# EasyEDA Pro project ProProject_STM32F103C6T6系统板_2024-03-26.epro

# Schematic Schematic1
Create Date: 2024-03-13; Page Name: P1; Project Name: STM32F103C6T6系统板; Schematic Name: Schematic1; Update Date: 2024-03-13; Company: 嘉立创EDA; Page Size: A4; Version: V1.0
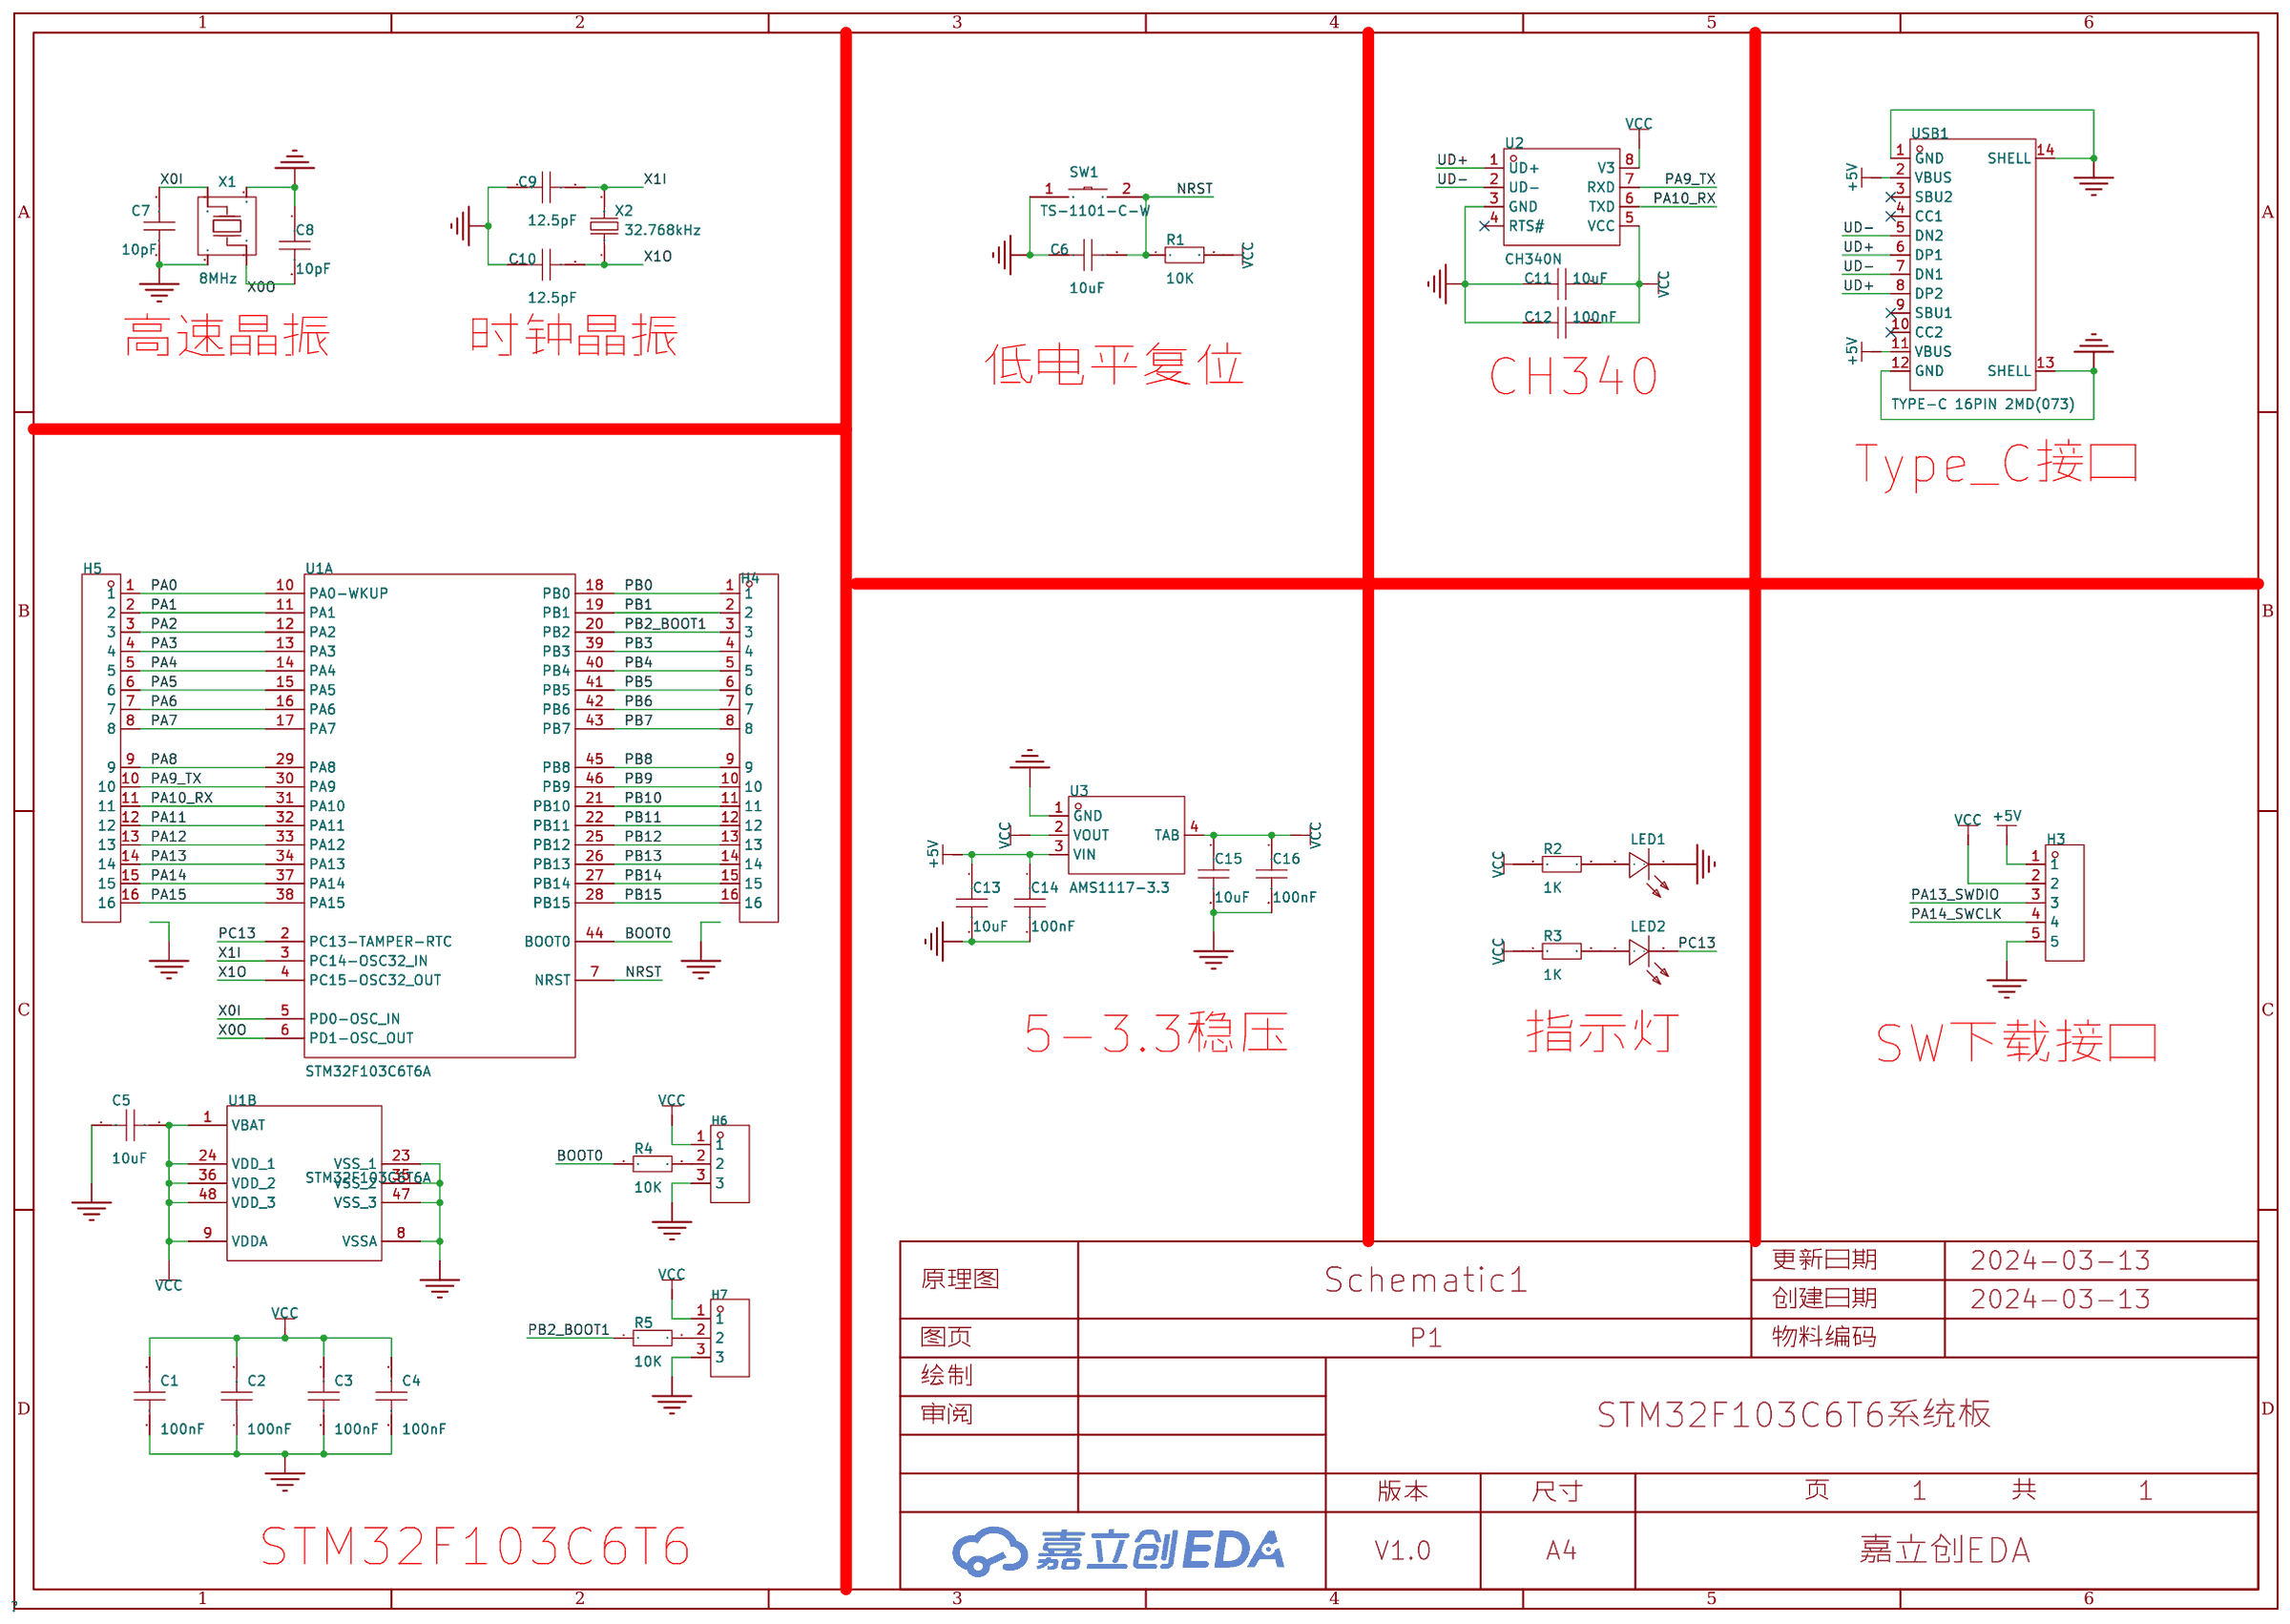
[diagram p0: schematic sheet]

## Parts
C1  100nF  [C0603]
C2  100nF  [C0603]
C3  100nF  [C0603]
C4  100nF  [C0603]
C5  10uF  [C0603]
C6  10uF  [C0603]
C7  10pF  [C0603]
C8  10pF  [C0603]
C9  12.5pF  [C0603]
C10  12.5pF  [C0603]
C11  10uF  [C0603]
C12  100nF  [C0603]
C13  10uF  [C0603]
C14  100nF  [C0603]
C15  10uF  [C0603]
C16  100nF  [C0603]
H3  PZ254-1-05-W-8.5  [HDR-TH_5P-P2.54-H-M-W10.4-N]
H4  X6511WV-20H-C60D30  [HDR-TH_20P-P2.54-V-M]
H5  X6511WV-20H-C60D30  [HDR-TH_20P-P2.54-V-M]
H6  PZ254V-11-03P  [HDR-TH_3P-P2.54-V-M]
H7  PZ254V-11-03P  [HDR-TH_3P-P2.54-V-M]
LED1  NCD0805R1  [LED0805-R-RD]
LED2  NCD0805R1  [LED0805-R-RD]
R1  10K  [R0603]
R2  1K  [R0603]
R3  1K  [R0603]
R4  10K  [R0603]
R5  10K  [R0603]
SW1  TS-1101-C-W  [SW-SMD_L6.0-W3.3-LS8.0]
U1  STM32F103C6T6A  [LQFP-48_L7.0-W7.0-P0.50-LS9.0-BL]  (sections 1,2)
U2  CH340N  [SOP-8_L4.9-W3.9-P1.27-LS6.0-BL]
U3  AMS1117-3.3  [SOT-223-3_L6.5-W3.5-P3.05-LS7.0]
USB1  TYPE-C 16PIN 2MD(073)  [USB-C-SMD_TYPE-C-6PIN-2MD-073]
X1  8MHz  [OSC-SMD_4P-L3.2-W2.5-BL]
X2  32.768kHz  [FC-135R_L3.2-W1.5]

## Library data of the parts
C1-C16 = CAP_0603: Supplier Footprint: 0603
H3 = PZ254-1-05-W-8.5: 插针结构:1x5P;间距:2.54mm;行距:-;圆针/方针:方针;安装类型:弯插;排数:单排;总PIN位数:5P;额定电流:3A;额定电压:-;配合针长度:6mm;塑高:2.5mm;端接针长度:-;触头材质:-;工作温度范围:-40℃~+105℃;焊接温度(最大值):260℃@10S;颜色:黑色;; LCSC Part Name: 1x5P 间距:2.54mm 方针 弯插; Supplier Part: C2894947; Manufacturer: HCTL(华灿天禄); Supplier Footprint: 弯插,P=2.54mm; JLCPCB Part Class: 扩展库; Datasheet: https://atta.szlcsc.com/upload/public/pdf/source/20230609/872AF364EDF8DB2CAF0930EAB94ECB6E.pdf; Supplier: LCSC; Pin Structure: 1x5P; Pitch: 2.54mm; Circluar Pins/Square Pins: 方针; Mounting Type: 弯插; Number of Rows: 单排; Number of Pins: 5P; Current Rating (Max): 3A; Length of Mating Pin: 6mm; Insulation Height: 2.5mm; Operating Temperature Range: -40℃~+105℃; Soldering Temperature(Max): 260℃@10S; Color: 黑色
H4 H5 = X6511WV-20H-C60D30: 插针结构:1x20P;间距:2.54mm;行距:2.54mm;圆针/方针:方针;安装类型:直插;排数:单排;总PIN位数:20P;额定电流:3A;额定电压:250V;配合针长度:6mm;塑高:2.5mm;端接针长度:3mm;触头材质:黄铜;触头镀层:金;工作温度范围:-40℃~+105℃;焊接温度(最大值):260℃;颜色:黑色;; LCSC Part Name: 1x20P 间距:2.54mm 方针 直插; Supplier Part: C725952; Manufacturer: XKB Connection(中国星坤); Supplier Footprint: 插件,P=2.54mm; JLCPCB Part Class: 扩展库; Datasheet: https://atta.szlcsc.com/upload/public/pdf/source/20221108/2FDDF9C694C8EDC81165E23F2EAAE597.pdf; Supplier: LCSC; Pin Structure: 1x20P; Pitch: 2.54mm; Row Spacing: 2.54mm; Circluar Pins/Square Pins: 方针; Mounting Type: 直插; Number of Rows: 单排; Number of Pins: 20P; Current Rating (Max): 3A; Voltage Rating (Max): 250V; Length of Mating Pin: 6mm; Insulation Height: 2.5mm; Length of End Connection Pin: 3mm; Contact Material: 黄铜; Contact Plating: 金; Operating Temperature Range: -40℃~+105℃; Soldering Temperature(Max): 260℃; Color: 黑色
H6 H7 = PZ254V-11-03P: 插针结构:1x3P;间距:2.54mm;行距:-;圆针/方针:方针;安装类型:直插;排数:单排;总PIN位数:3P;额定电流:3A;额定电压:250V;配合针长度:6mm;塑高:2.5mm;端接针长度:3mm;工作温度范围:-40℃~+105℃;颜色:黑色;; LCSC Part Name: 间距:2.54mm 1x3P 直插 方针; Supplier Part: C2937625; Manufacturer: XFCN(兴飞); Supplier Footprint: 插件,P=2.54mm; JLCPCB Part Class: 扩展库; Datasheet: https://atta.szlcsc.com/upload/public/pdf/source/20200309/C492402_8335C3D49C4E4C618838D59BB1D024C1.pdf; Supplier: LCSC; Pin Structure: 1x3P; Pitch: 2.54mm; Circluar Pins/Square Pins: 方针; Mounting Type: 直插; Number of Rows: 单排; Number of Pins: 3P; Current Rating (Max): 3A; Voltage Rating (Max): 250V; Length of Mating Pin: 6mm; Insulation Height: 2.5mm; Length of End Connection Pin: 3mm; Operating Temperature Range: -40℃~+105℃; Color: 黑色
LED1 LED2 = NCD0805R1: 灯头类型:-;发光颜色:红色;正向电压(VF):1.6V~2.6V;功率:65mW;正向电流:20mA;主波长:615nm~630nm;二极管配置:独立二极管;透镜颜色:无色透明透镜;色温:-;发光强度:67mcd~195mcd;发光角度:130°;载带方式:-;工作温度:-30℃~+85℃;; Supplier Part: C84256; Manufacturer: 国星光电; Supplier Footprint: 0805; JLCPCB Part Class: 基础库; Datasheet: https://atta.szlcsc.com/upload/public/pdf/source/20200820/C84256_F0A75A43B3EAD75808600A0514C76B99.pdf; Supplier: LCSC; Emitted Color: 红色; Forward Voltage (VF): 1.6V~2.6V; Power Dissipation: 65mW; Forward Current: 20mA; Dominant Wavelength: 615nm~630nm; Diode Configuration: 独立二极管; Lens Color: 无色透明透镜; Luminous Intensity: 67mcd~195mcd; Viewing Angle: 130°; Operating Temperature: -30℃~+85℃
R1-R5 = Res_0603: Supplier Footprint: 0603
SW1 = TS-1101-C-W: 电路结构:单刀单掷;按钮形状:矩形按钮;作用力:260gf;安装方式:立贴;开关长度:6mm;开关宽度:3.6mm;开关高度:2.5mm;带支架:不带;触点电流:50mA;额定电压(AC):-;额定电压(DC):12V;额定功率:-;绝缘电阻:-;带灯:无;机械寿命:5万次;; LCSC Part Name: 6*3.6*2.5mm 立贴 轻触开关; Supplier Part: C318938; Manufacturer: XKB Connectivity(中国星坤); Supplier Footprint: SMD; JLCPCB Part Class: 扩展库; Datasheet: https://atta.szlcsc.com/upload/public/pdf/source/20200227/C318938_C2E53B1EEDE37D980A33616AC086DE53.pdf; Supplier: LCSC; Circuit: 单刀单掷; Actuator Style: 矩形按钮; Operating Force: 260gf; Mounting Style: 立贴; Switch Length: 6mm; Switch Width: 3.6mm; Switch Height: 2.5mm; Strike Gundam: 不带; Contact Current: 50mA; Voltage Rating (DC): 12V; Actuator/Cap Color: 白色带淡绿; With Lamp: 无; Mechanical Life: 5万次; Operating Temperature: -30℃~+85℃
U1 = STM32F103C6T6A: CPU内核:CM3;程序存储容量:32KB;RAM总容量:10KB;GPIO端口数量:37;工作电压范围:2V~3.6V;CPU最大主频:72MHz;程序存储器类型:FLASH;; Supplier Part: C8303; Manufacturer: ST(意法半导体); Supplier Footprint: LQFP-48(7x7); JLCPCB Part Class: 扩展库; Datasheet: https://atta.szlcsc.com/upload/public/pdf/source/20140724/1457707171306.pdf; Supplier: LCSC; CPU Core: CM3; Program Storage Size: 32KB; RAM Size: 10KB; GPIO Ports Number: 37; Operating Voltage Range: 2V~3.6V; CPU Maximum Speed: 72MHz; Program Memory Type: FLASH; Operating Temperature Range: -40℃~+85℃; ADC (Bit): 12bit; Universal Serial Bus: 有; Peripheral/Function: DMA；片载温度传感器；PWM; Watchdog: 有; Infrared Data Association: 有; Low-Voltage Detect: 有; Direct Memory Access: 有; Internal Oscillator: 有
U2 = CH340N: LCSC Part Name: USB转串口芯片 CH340; Supplier Part: C2977777; Manufacturer: WCH(南京沁恒); Supplier Footprint: SOP-8; JLCPCB Part Class: 扩展库; Datasheet: https://atta.szlcsc.com/upload/public/pdf/source/20230530/6E401E9554E9F5311886CC8B3F89B62E.pdf; Supplier: LCSC
U3 = AMS1117-3.3_C5250992: 输出类型：固定 输出极性：正 最大输入电压：18V 输出电压：3.3V 输出电流：1A 电源纹波抑制比(PSRR)：60dB@(120Hz)。当前应用较多领域：三端稳压器，机顶盒; Supplier Part: C5250992; Manufacturer: TWGMC(台湾迪嘉); Supplier Footprint: SOT-223-3L; JLCPCB Part Class: 扩展库; Datasheet: https://atta.szlcsc.com/upload/public/pdf/source/20221109/A58A92B07670E85D28928AE371260E8D.pdf; Supplier: LCSC
USB1 = TYPE-C 16PIN 2MD(073): 连接器类型:Type-C;标准:-;公母:母;端口数量:1;触点数量:16P;安装方式:卧贴;额定电流 - 电源:5A;工作温度范围:-25℃~+85℃;; LCSC Part Name: Type-C 母 卧贴; Supplier Part: C2765186; Manufacturer: SHOU HAN(首韩); Supplier Footprint: SMD; JLCPCB Part Class: 扩展库; Datasheet: https://atta.szlcsc.com/upload/public/pdf/source/20211123/39B17C16241EAC15C5E277BDA434118E.pdf; Supplier: LCSC; Connector Type: Type-C; Gender: 母; Number of Ports: 1; Number of Contacts: 16P; Mounting Style: 卧贴; Current Rating - Power (Max): 5A; Operating Temperature Range: -25℃~+85℃
X1 = TAXM8M4RDBCCT2T: 晶振类型:贴片晶振;频率:8MHz;常温频差:±10ppm;外接负载电容:10pF;频率稳定度(全温):±15ppm;; LCSC Part Name: 8MHz ±10ppm 10pF; Supplier Part: C400090; Manufacturer: YJX(雅晶鑫); Supplier Footprint: SMD3225-4P; JLCPCB Part Class: 扩展库; Datasheet: https://atta.szlcsc.com/upload/public/pdf/source/20190626/C400090_CF95B89E745AFE4EF2E392EF8AC009D6.pdf; Supplier: LCSC; Crystal Type: 贴片晶振; Normal temperature Frequency Tolerance: ±10ppm; External load capacitor: 10pF; Frequency Stability(Full temperature range): ±15ppm; Equivalent Series Resistance (ESR): 250Ω; Operating Temperature: -40℃~+85℃
X2 = Q13FC13500004_C32346: 晶振类型:贴片晶振;频率:32.768kHz;常温频差:±20ppm;外接负载电容:12.5pF;; LCSC Part Name: 32.768kHz ±20ppm 12.5pF; Supplier Part: C32346; Manufacturer: EPSON(爱普生); Manufacturer Part: Q13FC13500004; Supplier Footprint: SMD3215-2P; JLCPCB Part Class: 基础库; Datasheet: https://atta.szlcsc.com/upload/public/pdf/source/20190108/C32346_746D6B07EAF90824457A96480007685F.pdf; Supplier: LCSC; Crystal Type: 贴片晶振; Normal temperature Frequency Tolerance: ±20ppm; External load capacitor: 12.5pF; Equivalent Series Resistance (ESR): 70kΩ; Operating Temperature: -40℃~+85℃

## Nets
+5V: C13.1 C14.1 H3.1 U3.3(VIN) USB1.2(VBUS) USB1.11(VBUS)
GND: C1.1 C2.1 C3.1 C4.1 C5.2 C6.2 C7.2 C8.1 C9.1 C10.1 C11.1 C12.1 C13.2 C14.2 C15.2 C16.2 H3.5 H6.3 H7.3 LED1.2(-) SW1.1 U1.8(VSSA) U1.23(VSS_1) U1.35(VSS_2) U1.47(VSS_3) U2.3(GND) U3.1(GND) USB1.1(GND) USB1.12(GND) USB1.13(SHELL) USB1.14(SHELL) X1.2 X1.4
VCC: C1.2 C2.2 C3.2 C4.2 C5.1 C11.2 C12.2 C15.1 C16.1 H3.2 H6.1 H7.1 R1.2 R2.1 R3.1 U1.1(VBAT) U1.9(VDDA) U1.24(VDD_1) U1.36(VDD_2) U1.48(VDD_3) U2.5(VCC) U2.8(V3) U3.2(VOUT) U3.4(TAB)
BOOT0: R4.1 U1.44(BOOT0)
NRST: C6.1 R1.1 SW1.2 U1.7(NRST)
PA0: H5.1 U1.10(PA0-WKUP)
PA1: H5.2 U1.11(PA1)
PA2: H5.3 U1.12(PA2)
PA3: H5.4 U1.13(PA3)
PA4: H5.5 U1.14(PA4)
PA5: H5.6 U1.15(PA5)
PA6: H5.7 U1.16(PA6)
PA7: H5.8 U1.17(PA7)
PA8: H5.9 U1.29(PA8)
PA9_TX: H5.10 U1.30(PA9) U2.7(RXD)
PA10_RX: H5.11 U1.31(PA10) U2.6(TXD)
PA11: H5.12 U1.32(PA11)
PA12: H5.13 U1.33(PA12)
PA13: H5.14 U1.34(PA13)
PA13_SWDIO: H3.3
PA14: H5.15 U1.37(PA14)
PA14_SWCLK: H3.4
PA15: H5.16 U1.38(PA15)
PB0: H4.1 U1.18(PB0)
PB1: H4.2 U1.19(PB1)
PB2_BOOT1: H4.3 R5.1 U1.20(PB2)
PB3: H4.4 U1.39(PB3)
PB4: H4.5 U1.40(PB4)
PB5: H4.6 U1.41(PB5)
PB6: H4.7 U1.42(PB6)
PB7: H4.8 U1.43(PB7)
PB8: H4.9 U1.45(PB8)
PB9: H4.10 U1.46(PB9)
PB10: H4.11 U1.21(PB10)
PB11: H4.12 U1.22(PB11)
PB12: H4.13 U1.25(PB12)
PB13: H4.14 U1.26(PB13)
PB14: H4.15 U1.27(PB14)
PB15: H4.16 U1.28(PB15)
PC13: LED2.2(-) U1.2(PC13-TAMPER-RTC)
UD+: U2.1(UD+) USB1.6(DP1) USB1.8(DP2)
UD-: U2.2(UD-) USB1.5(DN2) USB1.7(DN1)
X0I: C7.1 U1.5(PD0-OSC_IN) X1.3
X0O: C8.2 U1.6(PD1-OSC_OUT) X1.1
X1I: C9.2 U1.3(PC14-OSC32_IN) X2.2
X1O: C10.2 U1.4(PC15-OSC32_OUT) X2.1
$1N9882: H6.2 R4.2
$1N10003: H7.2 R5.2
Net-(LED1-1): LED1.1(+) R2.2
Net-(LED2-1): LED2.1(+) R3.2

Not connected (* = marked no-connect by the designer): U2 4(RTS#)*; USB1 3(SBU2)* 4(CC1)* 9(SBU1)* 10(CC2)*

## Notes on the sheet
- 高速晶振
- 时钟晶振
- 低电平复位
- CH340
- Type_C接口
- 5-3.3稳压
- 指示灯
- SW下载接口
- STM32F103C6T6

# Board PCB1
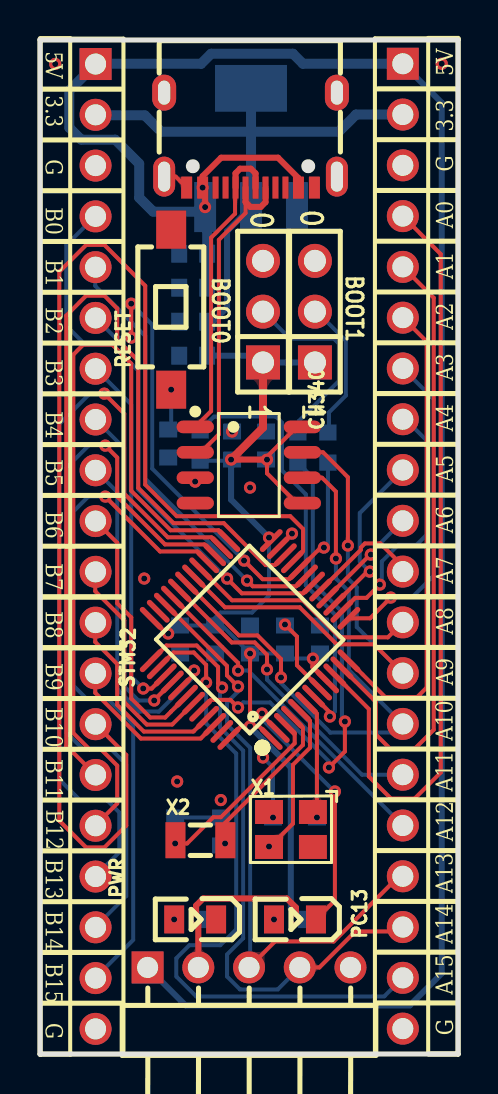
[diagram p1: board, top side]
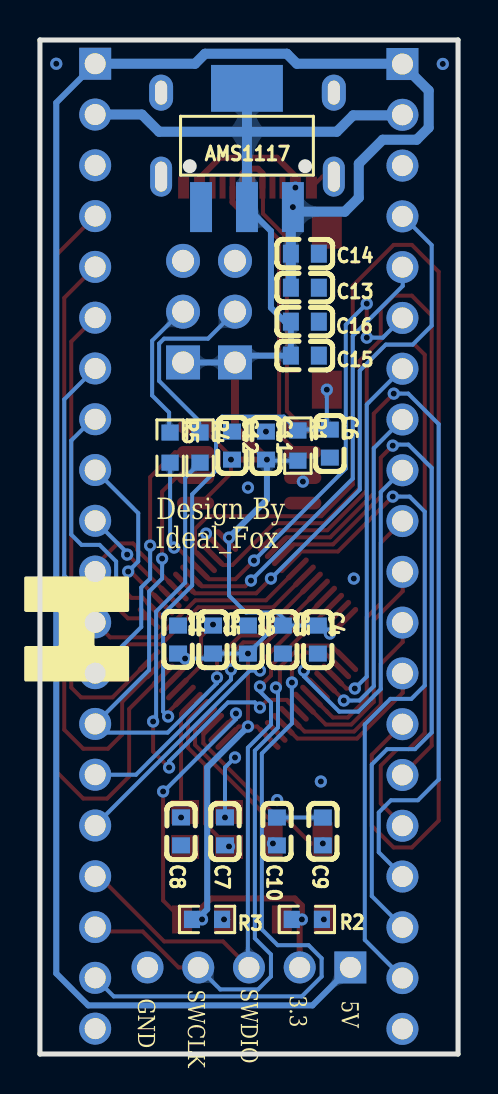
[diagram p2: board, bottom side, seen from below]

Outline 20.94 x 50.72 mm; copper layers: Top Layer, Bottom Layer. Coordinates in mm from the lower left corner of the outline.
Outline path: 0,50.72 20.94,50.72 20.94,0 0,0 0,50.72
Stack: Top Layer 0.035mm / Dielectric1 1.51mm FR4 er 4.5 / Bottom Layer 0.035mm

## Design rules (mm)
template: 自定义配置
spacing copperThickness1oz (default): track to track 0.15, other pairs 0.15 to 0.3
spacing copperThickness2oz: track to track 0.203, other pairs 0.152 to 0.3
track width copperThickness1oz (default): min 0.127, default 0.2, max 2.54
track width copperThickness2oz: min 0.203, default 0.254, max 2.54
differential pair differentialPair (default): width min 0.127, default 0.254, max 2.54; gap min 0.152, default 0.152
via viaSize (default): diameter min 0.5, default 0.5, max 10; hole min 0.3, default 0.3, max 6.3

## Placement (name value [footprint] x y rotation side)
AMS1117  AMS1117-3.3  [SOT-223-3_L6.5-W3.5-P3.05-LS7.0]  10.57 45.33 270 bottom
C1  100nF  [C0603]  14.02 20.73 270 bottom
C2  100nF  [C0603]  10.52 20.73 270 bottom
C3  100nF  [C0603]  8.77 20.73 90 bottom
C4  100nF  [C0603]  7.02 20.73 90 bottom
C5  10uF  [C0603]  12.27 20.73 90 bottom
C6  10uF  [C0603]  6.42 30.53 270 bottom
C7  10pF  [C0603]  11.67 11.13 90 bottom
C8  10pF  [C0603]  13.87 11.13 90 bottom
C9  12.5pF  [C0603]  6.77 11.13 270 bottom
C10  12.5pF  [C0603]  9.07 11.13 270 bottom
C11  10uF  [C0603]  9.62 30.43 270 bottom
C12  100nF  [C0603]  11.32 30.43 270 bottom
C13  10uF  [C0603]  7.67 38.33 180 bottom
C14  100nF  [C0603]  7.67 40.03 180 bottom
C15  10uF  [C0603]  7.67 34.93 180 bottom
C16  100nF  [C0603]  7.67 36.63 180 bottom
CH340  CH340N  [SOP-8_L4.9-W3.9-P1.27-LS6.0-BL]  10.46 29.46 270 top
H3  PZ254-1-05-W-8.5  [HDR-TH_5P-P2.54-H-M-W10.4-N]  10.47 4.33 0 top
H4  X6511WV-20H-C60D30  [HDR-TH_20P-P2.54-V-M]  2.79 25.37 270 top
H5  X6511WV-20H-C60D30  [HDR-TH_20P-P2.54-V-M#2]  18.17 25.43 90 top
H6  PZ254V-11-03P  [HDR-TH_3P-P2.54-V-M]  11.17 37.13 90 top
H7  PZ254V-11-03P  [HDR-TH_3P-P2.54-V-M]  13.77 37.13 90 top
PC13  NCD0805R1  [LED0805-R-RD]  12.77 6.73 180 top
PWR  NCD0805R1  [LED0805-R-RD]  7.77 6.73 180 top
R1  10K  [R0603]  8.02 30.43 270 bottom
R2  1K  [R0603]  7.57 6.73 180 bottom
R3  1K  [R0603]  12.57 6.73 180 bottom
R4  10K  [R0603]  12.92 30.33 90 bottom
R5  10K  [R0603]  14.42 30.33 90 bottom
RESET  TS-1101-C-W  [SW-SMD_L6.0-W3.3-LS8.0]  6.57 37.23 270 top
STM32  STM32F103C6T6A  [LQFP-48_L7.0-W7.0-P0.50-LS9.0-BL]  10.52 20.73 45 top
USB1  TYPE-C 16PIN 2MD(073)  [USB-C-SMD_TYPE-C-6PIN-2MD-073]  10.55 45.71 180 top
X1  8MHz  [OSC-SMD_4P-L3.2-W2.5-BL]  12.57 11.23 180 top
X2  32.768kHz  [FC-135R_L3.2-W1.5]  8.03 10.69 180 top

## Footprints (pads in the part's own frame, mm; a bottom-side part is the same pattern mirrored in y, then rotated)
C0603
  rect 0.8x0.9 smd: 1(-0.7,0) 2(0.7,0)
FC-135R_L3.2-W1.5
  rect 1x1.8 smd: 1(-1.25,0) 2(1.25,0)
HDR-TH_3P-P2.54-V-M
  rect 1.7x1.7 hole 1.1: 1(-2.54,0)
  round 1.7 hole 1.1: 2(0,0) 3(2.54,0)
HDR-TH_5P-P2.54-H-M-W10.4-N
  rect 1.6x1.6 hole 1.05: 1(-5.08,0)
  round 1.6 hole 1.05: 2(-2.54,0) 3(0,0) 4(2.54,0) 5(5.08,0)
HDR-TH_20P-P2.54-V-M
  rect 1.6x1.6 hole 1.05: 1(-24.149,-0.002)
  round 1.6 hole 1.05: 2(-21.609,-0.002) 3(-19.069,-0.002) 4(-16.529,-0.002) 5(-13.989,-0.002) 6(-11.449,-0.002) 7(-8.909,-0.002) 8(-6.369,-0.002) 9(-3.829,-0.002) 10(-1.289,-0.002) 11(1.251,-0.002) 12(3.791,-0.002) 13(6.331,-0.002) 14(8.871,-0.002) 15(11.411,-0.002) 16(13.951,-0.002) 17(16.491,-0.002) 18(19.031,-0.002) 19(21.571,-0.002) 20(24.111,-0.002)
HDR-TH_20P-P2.54-V-M#2
  rect 1.6x1.6 hole 1.05: 1(24.099,-0.002)
  round 1.6 hole 1.05: 2(21.559,-0.002) 3(19.019,-0.002) 4(16.479,-0.002) 5(13.939,-0.002) 6(11.399,-0.002) 7(8.859,-0.002) 8(6.319,-0.002) 9(3.779,-0.002) 10(1.239,-0.002) 11(-1.301,-0.002) 12(-3.841,-0.002) 13(-6.381,-0.002) 14(-8.921,-0.002) 15(-11.461,-0.002) 16(-14.001,-0.002) 17(-16.541,-0.002) 18(-19.081,-0.002) 19(-21.621,-0.002) 20(-24.161,-0.002)
LED0805-R-RD
  rect 1x1.399 smd: 1(1.05,0) 2(-1.05,0)
LQFP-48_L7.0-W7.0-P0.50-LS9.0-BL
  oval 0.27x1.5 smd: 1(-2.75,-4.25) 2(-2.25,-4.25) 3(-1.75,-4.25) 4(-1.25,-4.25) 5(-0.75,-4.25) 6(-0.25,-4.25) 7(0.25,-4.25) 8(0.75,-4.25) 9(1.25,-4.25) 10(1.75,-4.25) 11(2.25,-4.25) 12(2.75,-4.25) 25(2.75,4.25) 26(2.25,4.25) 27(1.75,4.25) 28(1.25,4.25) 29(0.75,4.25) 30(0.25,4.25) 31(-0.25,4.25) 32(-0.75,4.25) 33(-1.25,4.25) 34(-1.75,4.25) 35(-2.25,4.25) 36(-2.75,4.25)
  oval 1.5x0.27 smd: 13(4.25,-2.75) 14(4.25,-2.25) 15(4.25,-1.75) 16(4.25,-1.25) 17(4.25,-0.75) 18(4.25,-0.25) 19(4.25,0.25) 20(4.25,0.75) 21(4.25,1.25) 22(4.25,1.75) 23(4.25,2.25) 24(4.25,2.75) 37(-4.25,2.75) 38(-4.25,2.25) 39(-4.25,1.75) 40(-4.25,1.25) 41(-4.25,0.75) 42(-4.25,0.25) 43(-4.25,-0.25) 44(-4.25,-0.75) 45(-4.25,-1.25) 46(-4.25,-1.75) 47(-4.25,-2.25) 48(-4.25,-2.75)
OSC-SMD_4P-L3.2-W2.5-BL
  rect 1.4x1.2 smd: 1(-1.1,-0.875) 2(1.1,-0.875) 3(1.1,0.875) 4(-1.1,0.875)
R0603
  rect 0.806x0.864 smd: 1(-0.753,0) 2(0.753,0)
SOP-8_L4.9-W3.9-P1.27-LS6.0-BL
  oval 0.63x1.865 smd: 1(-1.905,-2.683) 2(-0.635,-2.683) 3(0.635,-2.683) 4(1.905,-2.683) 5(1.905,2.683) 6(0.635,2.683) 7(-0.635,2.683) 8(-1.905,2.683)
SOT-223-3_L6.5-W3.5-P3.05-LS7.0
  rect 2.5x1.1 smd: 1(2.97,-2.3) 2(2.97,0) 3(2.97,2.3)
  rect 2.34x3.6 smd: 4(-2.97,0)
SW-SMD_L6.0-W3.3-LS8.0
  rect 1.9x1.5 smd: 1(-4,0) 2(4,0)
USB-C-SMD_TYPE-C-6PIN-2MD-073
  rect 0.55x1.1 smd: 1(-3.2,2.375) 2(-2.4,2.375) 11(2.4,2.375) 12(3.2,2.375)
  rect 0.3x1.1 smd: 3(-1.75,2.375) 4(-1.25,2.375) 5(-0.75,2.375) 6(-0.25,2.375) 7(0.25,2.375) 8(0.75,2.375) 9(1.25,2.375) 10(1.75,2.375)
  oval 1.1x2 hole 0.6x1.5: 13(-4.325,1.825) 14(4.325,1.825)
  oval 1.2x1.8 hole 0.6x1.2: 13(-4.325,-2.375) 14(4.325,-2.375)

## Nets
+5V: AMS1117.3 C13.1 C14.1 H3.1 H4.1 H5.1 USB1.2 USB1.11
GND: AMS1117.1 C1.1 C2.1 C3.1 C4.1 C5.2 C6.2 C7.2 C8.1 C9.1 C10.1 C11.1 C12.1 C13.2 C14.2 C15.2 C16.2 CH340.3 H3.5 H4.3 H4.20 H5.3 H5.20 H6.3 H7.3 PWR.2 RESET.1 STM32.8 STM32.23 STM32.35 STM32.47 USB1.1 USB1.12 USB1.13 USB1.14 X1.2 X1.4
VCC: AMS1117.2 AMS1117.4 C1.2 C2.2 C3.2 C4.2 C5.1 C11.2 C12.2 C15.1 C16.1 CH340.5 CH340.8 H3.2 H4.2 H5.2 H6.1 H7.1 R1.2 R2.1 R3.1 STM32.1 STM32.9 STM32.24 STM32.36 STM32.48
BOOT0: R4.1 STM32.44
NRST: C6.1 R1.1 RESET.2 STM32.7
PA0: H5.4 STM32.10
PA1: H5.5 STM32.11
PA2: H5.6 STM32.12
PA3: H5.7 STM32.13
PA4: H5.8 STM32.14
PA5: H5.9 STM32.15
PA6: H5.10 STM32.16
PA7: H5.11 STM32.17
PA8: H5.12 STM32.29
PA9_TX: CH340.7 H5.13 STM32.30
PA10_RX: CH340.6 H5.14 STM32.31
PA11: H5.15 STM32.32
PA12: H5.16 STM32.33
PA13_SWDIO: H3.3 H5.17 STM32.34
PA14_SWCLK: H3.4 H5.18 STM32.37
PA15: H5.19 STM32.38
PB0: H4.4 STM32.18
PB1: H4.5 STM32.19
PB2_BOOT1: H4.6 R5.1 STM32.20
PB3: H4.7 STM32.39
PB4: H4.8 STM32.40
PB5: H4.9 STM32.41
PB6: H4.10 STM32.42
PB7: H4.11 STM32.43
PB8: H4.12 STM32.45
PB9: H4.13 STM32.46
PB10: H4.14 STM32.21
PB11: H4.15 STM32.22
PB12: H4.16 STM32.25
PB13: H4.17 STM32.26
PB14: H4.18 STM32.27
PB15: H4.19 STM32.28
PC13: PC13.2 STM32.2
UD+: CH340.1 USB1.6 USB1.8
UD-: CH340.2 USB1.5 USB1.7
X0I: C7.1 STM32.5 X1.3
X0O: C8.2 STM32.6 X1.1
X1I: C9.2 STM32.3 X2.2
X1O: C10.2 STM32.4 X2.1
$1N4614: PWR.1 R2.2
$1N4739: PC13.1 R3.2
$1N9882: H6.2 R4.2
$1N10003: H7.2 R5.2

Pads without a net: CH340 4; USB1 3 4 9 10

## Via types
v1: diameter 0.61, hole 0.305, Top Layer to Bottom Layer, 60 vias

## Routing (per net, layer and track width the routed paths; a pad name or vN(x,y) marks a point on that pad's centre or on a via; arc(x,y) is an arc through that point)
+5V: length 103.4
  Top Layer w0.3: USB1.2 12.95,43.81 11.92,44.83 9.07,44.83 8.15,43.91 v1(8.15,43.34) 8.27,43.21 v1(8.27,42.36)
  Bottom Layer w0.3: H5.1 20.12,47.58 20.12,4.03 18.52,2.43 7.29,2.43 H3.1
  Bottom Layer w0.5: C13.1 C14.1 8.37,42.26 v1(8.27,42.36) 8.04,42.13 5.67,42.13 4.97,42.83 4.97,44.53 3.77,45.73 2.07,45.73 1.47,46.33 1.47,48.19 2.81,49.53 8.07,49.53 8.57,50.03 12.67,50.03 13.17,49.53 18.17,49.53
GND: length 11.8
  Top Layer w0.2: v1(12.62,26.03) 12.62,26.01 STM32.23 ; 14.06,18.26 12.87,19.44 12.87,20.88 v1(12.27,21.48) ; USB1.12 6.8,43.89 USB1.14
  Bottom Layer w0.2: v1(11.17,14.83) 11.67,14.33 v1(11.67,11.83) ; C10.1 C9.1
  vias: v1(0.76,49.52) v1(5.22,23.78) v1(6.87,13.63) v1(7.77,28.63) v1(9.06,12.7) v1(9.62,31.13) v1(10.52,28.33) v1(20.12,49.53)
VCC: length 99.2
  Top Layer w0.2: v1(10.52,16.38) 10.06,16.38 STM32.48 ; v1(10.52,16.38) 10.98,16.38 STM32.1 ; v1(10.52,16.38) v1(10.52,20.03) ; CH340.5 12.86,27.56 11.37,29.05 v1(11.37,29.73) 11.37,29.88 12.86,31.37 CH340.8 ; STM32.36 6.33,21.03 v1(6.42,21.03)
  Top Layer w0.254: STM32.9 13.67,19.35 v1(13.67,19.78)
  Top Layer w0.3: H3.2 7.93,6.62 v1(7.82,6.73) 7.82,7.43 8.18,7.78 12.37,7.78 12.82,7.33 v1(12.82,6.73) ; v1(11.37,29.73) v1(9.57,29.73)
  Top Layer w0.4: H6.1 11.17,31.33 v1(9.57,29.73)
  Bottom Layer w0.2: 7.97,29.68 9.52,29.68 v1(9.57,29.73) ; 8.39,21.43 C3.2 9.12,21.43 v1(10.52,20.03) C5.1 12.52,19.78 v1(13.67,19.78) ; 8.39,21.43 C4.2 ; 8.39,21.43 9.04,22.08 10.62,22.08 11.47,22.93 v1(11.47,25.83)
  Bottom Layer w0.254: C4.2 6.82,21.43 v1(6.42,21.03)
  Bottom Layer w0.3: AMS1117.2 9.37,41.16 9.37,37.33 8.67,36.63 C16.1 C15.1 10.83,34.93 H6.1 H7.1 ; 13.07,6.73 v1(12.82,6.73) ; 13.07,6.73 R3.1 ; 13.07,6.73 12.56,7.24 12.56,14.34 v1(10.52,16.38) ; v1(9.57,29.73) 9.57,27.73 v1(11.47,25.83)
  Bottom Layer w0.5: AMS1117.4 10.57,46.13 ; 10.57,46.13 6.07,46.13 5.25,46.95 2.77,46.95 ; 10.57,46.13 14.97,46.13 15.83,46.99 18.17,46.99 ; 10.57,46.13 AMS1117.2
BOOT0: length 25
  Top Layer w0.2: v1(9.92,17.33) 9.54,17.71 8.56,17.71 STM32.44 ; v1(15.27,16.63) 15.27,15.13 v1(14.47,14.33)
  Bottom Layer w0.2: R4.1 13.67,28.83 13.67,23.58 15.12,22.13 15.12,16.78 v1(15.27,16.63) ; v1(9.92,17.33) 10.18,17.59 11.52,17.59 14.47,14.64 v1(14.47,14.33)
NRST: length 25.5
  Top Layer w0.2: v1(14.52,16.88) 14.52,17.08 STM32.7
  Bottom Layer w0.2: v1(14.52,16.88) 14.77,17.13 14.77,21.98 13.32,23.44 13.32,27.99 12.12,29.19 12.12,31.58 11.82,31.88 8.72,31.88 R1.1 7.97,31.23 C6.1 6.57,31.38 v1(6.57,33.23)
PA0: length 39
  Top Layer w0.2: STM32.10 16.47,17.26 16.47,13.88 17.57,12.78 18.77,12.78 20.07,14.08 20.07,40.01 H5.4
PA1: length 31.4
  Top Layer w0.2: STM32.11 16.82,17.61 16.82,15.98 17.53,15.27 18.77,15.27 19.72,16.22 19.72,37.82 H5.5
PA2: length 23.9
  Top Layer w0.2: STM32.12 17.31,17.84 18.88,17.84 19.37,18.33 19.37,35.63 H5.6
PA3: length 16.1
  Top Layer w0.2: v1(17.57,22.83) 16.53,21.79 STM32.13
  Bottom Layer w0.2: H5.7 19.72,32.74 19.72,23.93 18.64,22.85 17.59,22.85 v1(17.57,22.83)
PA4: length 12.8
  Top Layer w0.2: STM32.14 15.79,22.81 16.36,22.81 v1(17.02,23.48)
  Bottom Layer w0.2: v1(17.02,23.48) 17.12,23.58 17.12,24.64 17.95,25.47 18.86,25.47 19.37,25.98 19.37,30.68 18.3,31.75 H5.8
PA5: length 8.6
  Top Layer w0.2: v1(16.52,24.13) 16.4,24.13 STM32.15
  Bottom Layer w0.2: v1(16.52,24.13) 16.02,24.64 16.02,27.05 H5.9
PA6: length 5.4
  Top Layer w0.2: v1(16.57,24.98) 16.54,24.98 STM32.16
  Bottom Layer w0.2: H5.10 16.57,25.07 v1(16.57,24.98)
PA7: length 5.9
  Top Layer w0.2: 14.06,23.21 16.07,25.22 16.07,25.34 16.27,25.54 17.05,25.54 18.17,24.41 H5.11
PA8: length 11.9
  Top Layer w0.2: STM32.29 9.62,22.69 13.16,22.69 15.01,20.84 17.42,20.84 H5.12
PA9_TX: length 26.2
  Top Layer w0.2: CH340.7 14.18,30.1 15.42,28.85 v1(15.42,25.43) ; STM32.30 9.26,22.34 13.01,22.34 14.86,20.49 16.73,20.49 H5.13
  Bottom Layer w0.2: v1(15.42,25.43) 15.42,23.78 15.87,23.34 15.87,21.36 H5.13
PA10_RX: length 29.8
  Top Layer w0.2: CH340.6 14.13,28.83 14.82,28.13 v1(14.82,24.78) ; STM32.31 9.96,20.94 10.9,20.94 12.07,19.76 v1(12.07,18.83)
  Bottom Layer w0.2: v1(12.07,18.83) 12.07,18.55 14.54,16.08 17.74,16.08 H5.14 15.47,19.21 15.47,23.13 14.82,23.78 v1(14.82,24.78)
PA11: length 15.7
  Top Layer w0.2: v1(11.37,19.23) 11.37,19.97 10.75,20.59 9.61,20.59 6.99,23.21
  Bottom Layer w0.2: v1(11.37,19.23) 11.37,18.73 16.13,13.97 H5.15
PA12: length 16.5
  Top Layer w0.2: v1(9.92,19.18) 9.92,19.56 STM32.33
  Bottom Layer w0.2: v1(9.92,19.18) 10.42,19.18 H5.16
PA13_SWDIO: length 30
  Top Layer w0.2: v1(9.92,18.38) 9.37,18.94 9.37,19.41 STM32.34 ; H3.3 11.77,5.63 14.72,5.63 17.98,8.89 H5.17
  Bottom Layer w0.2: v1(9.92,18.38) 9.92,18.13 9.37,17.58 9.37,16.48 10.53,15.32 10.53,4.39 H3.3
PA14_SWCLK: length 31.2
  Top Layer w0.2: H3.4 14,4.33 15.79,6.13 17.95,6.13 H5.18 ; STM32.37 6.33,20.43 7.85,20.43 8.92,19.36 8.92,18.53 9.12,18.33
  Bottom Layer w0.2: v1(9.12,18.33) 9.02,18.23 9.02,16.34 10.18,15.18 10.18,5.79 9.37,4.98 9.37,3.88 10.02,3.23 11.91,3.23 H3.4 12.73,4.33
PA15: length 33.5
  Top Layer w0.2: v1(8.32,18.58) 8.32,19.46 7.71,20.08 6.69,20.08 STM32.38
  Bottom Layer w0.2: v1(8.32,18.58) 8.32,16.54 9.83,15.03 9.83,6.24 9.03,5.44 7.49,5.44 6.83,4.79 6.83,3.88 7.83,2.88 17.24,2.88 H5.19
PB0: length 27.7
  Top Layer w0.2: v1(9.37,23.78) 10.11,23.04 13.19,23.04 STM32.18
  Bottom Layer w0.2: v1(9.37,23.78) 4.92,28.23 4.92,34.18 3.62,35.48 2.27,35.48 1.32,36.43 1.32,40.46 2.77,41.91
PB1: length 22.1
  Top Layer w0.2: v1(10.37,23.68) 10.66,23.4 12.83,23.4 STM32.19
  Bottom Layer w0.2: 2.77,39.37 2.77,38.42 5.27,35.91 5.27,28.78 v1(10.37,23.68)
PB2_BOOT1: length 28.5
  Top Layer w0.2: v1(4.57,35.83) v1(4.57,37.53) ; v1(10.22,24.68) 11.15,23.75 12.48,23.75 STM32.20 14.06,25.33 v1(14.22,25.33)
  Bottom Layer w0.2: v1(14.22,25.33) 14.42,25.53 R5.1 ; v1(10.22,24.68) 5.62,29.28 5.62,36.48 v1(4.57,37.53) ; 2.77,36.83 3.77,35.83 v1(4.57,35.83)
PB3: length 18.4
  Top Layer w0.2: v1(5.17,18.28) 5.6,18.28 STM32.39
  Bottom Layer w0.2: 2.77,34.29 4.57,32.49 4.57,18.88 v1(5.17,18.28)
PB4: length 17.1
  Top Layer w0.2: STM32.40 5.72,17.7 v1(5.72,17.68)
  Bottom Layer w0.2: 2.77,31.75 4.22,30.3 4.22,18.4 4.94,17.68 v1(5.72,17.68)
PB5: length 18
  Top Layer w0.2: 6.99,18.26 7.72,18.99 v1(7.72,19.18)
  Bottom Layer w0.2: 2.77,29.21 3.87,28.11 3.87,18.25 5,17.13 5.95,17.13 7.72,18.9 v1(7.72,19.18)
PB6: length 13.2
  Top Layer w0.2: 2.77,26.67 3.87,25.57 3.87,22.54 4.57,21.84 4.57,17.78 5.52,16.83 6.27,16.83 6.57,17.13 6.57,17.13 STM32.42
PB7: length 11.5
  Top Layer w0.2: 2.77,24.13 2.77,23.15 4.22,21.7 4.22,17.61 5.35,16.48 6.63,16.48 STM32.43
PB8: length 10
  Top Layer w0.2: 2.77,21.59 2.77,20.61 3.87,19.51 3.87,17.46 5.2,16.13 7.69,16.13 8.4,16.84
PB9: length 8.2
  Top Layer w0.2: 2.77,19.05 2.77,18.07 5.06,15.78 8.05,15.78 STM32.46
PB10: length 63.9
  Top Layer w0.2: 12.64,24.62 13.18,25.15 13.18,26.26 12.54,26.9 6.85,26.9 5.27,28.48 5.27,38.42 3.23,40.47 2.31,40.47 0.97,39.13 0.97,11.67 2.31,10.33 3.23,10.33 4.32,11.42 4.32,14.96 2.77,16.51
PB11: length 45.4
  Top Layer w0.2: STM32.22 11.77,24.46 11.3,24.46 9.21,26.55 6.69,26.55 4.92,28.32 4.92,34.68 3.87,35.73 3.87,37.29 3.23,37.93 2.31,37.93 1.32,36.94 1.32,15.42 2.77,13.97
PB12: length 41
  Top Layer w0.2: 2.77,11.43 3.87,12.53 3.87,14.43 3.05,15.25 2.47,15.25 1.67,16.05 1.67,34.98 2.17,35.48 3.63,35.48 4.57,34.53 4.57,28.17 6.55,26.2 8.94,26.2 STM32.25
PB13: length 39.5
  Top Layer w0.2: STM32.26 8.59,25.84 6.4,25.84 4.22,28.03 4.22,32.03 v1(3.22,33.03)
  Bottom Layer w0.2: 2.77,8.89 3.97,10.09 3.97,12.08 3.36,12.69 2.01,12.69 0.97,13.73 0.97,31.51 2.49,33.03 v1(3.22,33.03)
PB14: length 37
  Top Layer w0.2: STM32.27 8.24,25.49 6.26,25.49 3.87,27.88 3.87,29.83 v1(3.27,30.43)
  Bottom Layer w0.2: 2.77,6.35 4.32,7.9 4.32,14.48 3.55,15.25 2.15,15.25 1.32,16.08 1.32,29.32 2.48,30.48 3.22,30.48 v1(3.27,30.43)
PB15: length 34.4
  Top Layer w0.2: v1(3.27,27.88) 6.02,25.14 7.88,25.14 8.4,24.62
  Bottom Layer w0.2: v1(3.27,27.88) 2.42,27.88 1.67,27.13 1.67,18.43 2.34,17.76 3.39,17.76 4.67,16.48 4.67,5.71 2.77,3.81
PC13: length 13.5
  Top Layer w0.2: v1(14.77,13.13) 14.77,7.68 PC13.2 ; v1(11.12,17.03) 11.12,16.95 STM32.2
  Bottom Layer w0.2: v1(11.12,17.03) 11.12,16.75 14.74,13.13 v1(14.77,13.13)
UD+: length 15.4
  Top Layer w0.2: USB1.8 9.77,43.31 9.77,42.03 8.57,40.83 8.57,32.16 CH340.1
  Top Layer w0.3: USB1.6 10.8,44.05 10.56,44.28 10.02,44.28 9.8,44.06 USB1.8
UD-: length 16.4
  Top Layer w0.2: CH340.2 8.06,30.1 8.96,31 8.96,40.72 10.3,42.06 10.3,42.61
  Top Layer w0.3: USB1.7 10.3,42.61 10.53,42.37 11.06,42.37 11.3,42.61 USB1.5
X0I: length 7.9
  Top Layer w0.2: STM32.5 13.52,16.67 13.52,15.32 12.67,14.47 12.67,11.53 11.53,10.38 v1(11.47,10.38)
X0O: length 5.7
  Top Layer w0.2: X1.1 13.87,12.31 13.87,17.03 STM32.6
  vias: v1(13.87,11.83)
X1I: length 9.2
  Top Layer w0.2: STM32.3 12.76,16.02 12.76,15.54 9.06,11.84 8.68,11.84 7.37,10.53 v1(6.77,10.53)
X1O: length 8.1
  Top Layer w0.2: v1(9.27,10.53) 9.27,11.56 13.17,15.46 13.17,16.31 12.64,16.84
$1N4614:
  vias: v1(6.72,6.73)
$1N4739:
  vias: v1(11.72,6.73)
$1N9882: length 9.7
  Bottom Layer w0.2: H6.2 12.52,35.78 14.72,35.78 14.97,35.53 14.97,33.67 12.97,31.67 12.97,31.08
$1N10003: length 7.1
  Bottom Layer w0.2: H7.2 13.87,37.13 15.32,35.68 15.32,32.94 14.47,32.09 14.47,31.08

## Copper pours and planes (outline as drawn; the poured copper is in the pictures)
GND on Top Layer: 0,50.72 20.94,50.72 20.94,0 0,0
GND on Bottom Layer: 0,50.72 20.94,50.72 20.94,0 0,0

Small or netless copper shapes (teardrops, artwork), in the pictures only: 107 on Top Layer, 87 on Bottom Layer

## Text on the board
Bottom Silkscreen Layer: 5V | 3.3 | SWDIO | SWCLK | GND | Ideal_Fox | Design By
Top Silkscreen Layer: BOOT0 | BOOT1 | 1 | 0 | 5V | 3.3 | G | B0 | B1 | B2 | B3 | B4 | B5 | B6 | B7 | B8 | B9 | B10 | B11 | B13 | B14 | B15 | B12 | A10 | A11 | A13 | A14 | A15 | A0 | A1 | A2 | A3 | A4 | A5 | A6 | A7 | A8 | A9 | A12
